# Altium schematic sheet Sheet2.SchDoc
size A4
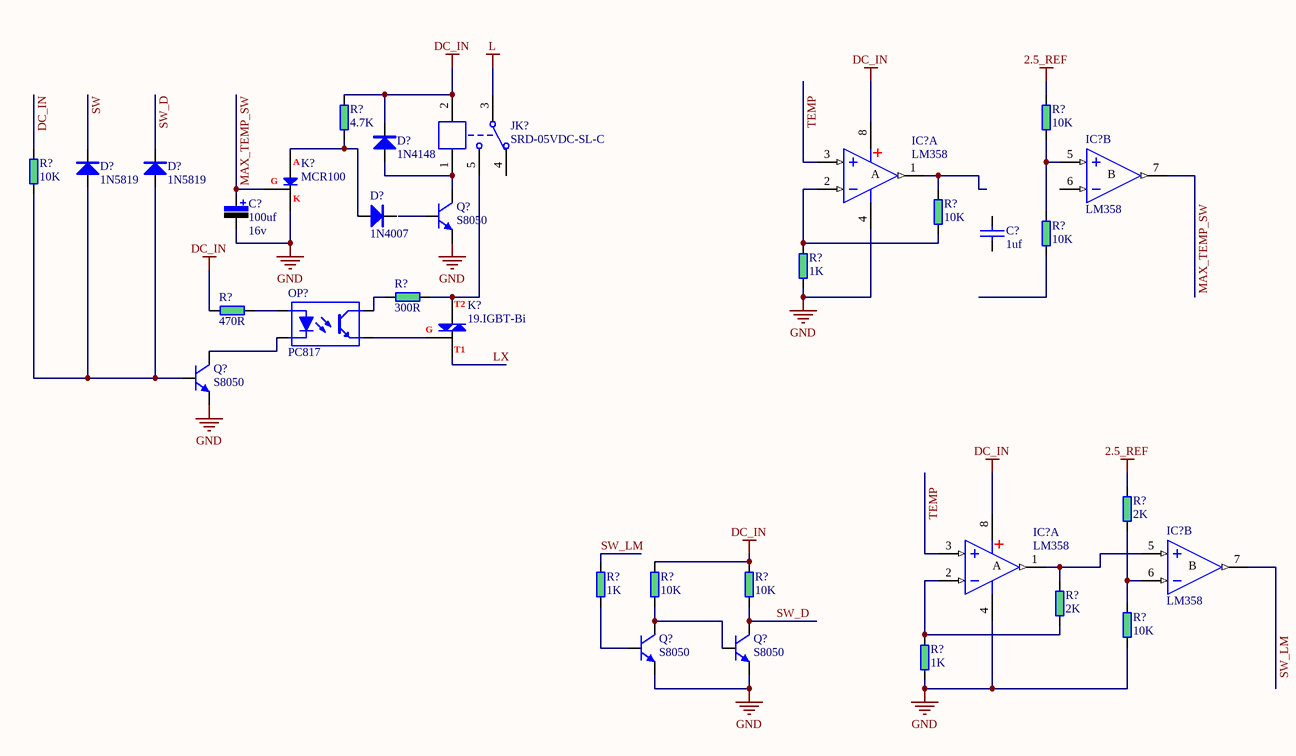
[diagram p0: Sheet2.SchDoc]

## Parts
(Parts that share a designator on the sheet are numbered #1, #2 ... from top to bottom, then left to right.)
C?#1  value 100uf  value 16v  [CAP 25v22uf H（4*8）]  (hidden comment: 05.Cap-EC)
C?#2  value 1uf  [C 0603]  (hidden comment: 04.Cap)
D?#1  1N4148  [D 1N4148-LL34]
D?#2  1N5819  [D 1N5819W-SOD123]
D?#3  1N5819  [D 1N5819W-SOD123]
D?#4  1N4007  [D 1N4007-SOD123]
IC?#1  LM358  [SOP8]  (part A of 2)
IC?#2  LM358  [SOP8]  (part B of 2)
IC?#3  LM358  [SOP8]  (part A of 2)
IC?#4  LM358  [SOP8]  (part B of 2)
JK?  SRD-05VDC-SL-C  [SRD-C_B]
K?#1  MCR100  [IGBT MCR100-SOT23]
K?#2  19.IGBT-Bi  [IGBT BT139]
OP?  PC817  [OP MOC3041]
Q?#1  S8050  [BJT-S8050-SOT23]
Q?#2  S8050  [BJT-S8050-SOT23]
Q?#3  S8050  [BJT-S8050-SOT23]
Q?#4  S8050  [BJT-S8050-SOT23]
R?#1  4.7K  [R 0603]
R?#2  10K  [R 0603]
R?#3  10K  [R 0603]
R?#4  10K  [R 0603]
R?#5  10K  [R 0603]
R?#6  1K  [R 0603]
R?#7  300R  [RS 1/4W-V3]
R?#8  470R  [R 0603]
R?#9  2K  [R 0603]
R?#10  1K  [R 0603]
R?#11  10K  [R 0603]
R?#12  10K  [R 0603]
R?#13  2K  [R 0603]
R?#14  10K  [R 0603]
R?#15  1K  [R 0603]

## Nets
2.5_REF: R?#2.2 R?#9.2
DC_IN: D?#1.K IC?#1.8(V+) IC?#3.8(V+) JK?.2 R?#1.2 R?#3.2 R?#8.1 R?#11.2 R?#12.2
GND: C?#1.2 IC?#1.4(V-) IC?#3.4(V-) K?#1.K Q?#1.E Q?#2.E Q?#3.E Q?#4.E R?#6.1 R?#14.1 R?#15.1
L: JK?.3
LX: K?#2.T1
MAX_TEMP_SW: C?#1.1 IC?#2.7(OUT) K?#1.G
SW: D?#2.K
SW_D: D?#3.K Q?#4.C R?#12.1
SW_LM: IC?#4.7(OUT) R?#10.2
TEMP: IC?#1.3(IN+) IC?#3.3(IN+)
NetD?#1_A: D?#1.A JK?.1 Q?#1.C
NetD?#2_A: D?#2.A D?#3.A Q?#2.B R?#3.1
NetD?#4_A: D?#4.A K?#1.A R?#1.1
NetIC?#1_1: IC?#1.1(OUT) R?#4.2
NetIC?#1_2: IC?#1.2(IN-) R?#4.1 R?#6.2
NetIC?#2_5: IC?#2.5(IN+) R?#2.1 R?#5.2
NetIC?#3_1: IC?#3.1(OUT) IC?#4.5(IN+) R?#13.2
NetIC?#3_2: IC?#3.2(IN-) R?#13.1 R?#15.2
NetIC?#4_6: IC?#4.6(IN-) R?#9.1 R?#14.2
NetJK?_5: JK?.5 K?#2.T2 R?#7.2
NetK?#2_G: K?#2.G OP?.E
NetOP?_A: OP?.A R?#8.2
NetOP?_C: OP?.C R?#7.1
NetOP?_K: OP?.K Q?#2.C
NetQ?#3_B: Q?#3.B R?#10.1
NetQ?#3_C: Q?#3.C Q?#4.B R?#11.1

Not connected (* = marked no-connect by the designer): C?#2 1 2; D?#4 K; IC?#2 6(IN-); JK? 4; Q?#1 B; R?#5 1

## Notes on the sheet
- (in symbol LM358, part A) A
- (in symbol LM358, part B) B

## Library data of the parts
C?#1 = 05.Cap-EC: 电解电容
C?#2 = 04.Cap: 电容
D?#1-D?#4 = 12.Diode: 二极管
IC?#1-IC?#4 = LM358: 双路运放; 版权归属: 源创客; BOM名称: 双路运放; 学习资源: www.ooocke.com
JK? = SRD-05VDC-SL-C: 5V一组转换; BOM名称: 5V继电器; 版权归属: 源创客; 学习资源: www.ooocke.com
K?#1 = 20.IGBT: 单向可控硅-晶闸管
K?#2 = 19.IGBT-Bi: 双向可控硅-晶闸管
OP? = 17.Optocoupler: 光耦
Q?#1-Q?#4 = 07.BJT(N): 三极管 NPN
R?#1-R?#15 = 01.Res: 电阻